# EAGLE design lab3_task2 (EAGLE 6.5.0)
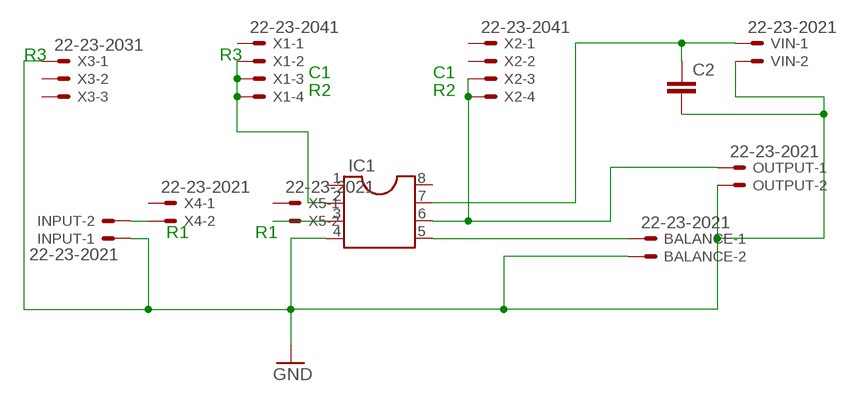
[diagram p0: schematic, sheet 1]

## Parts
BALANCE  22-23-2021  [22-23-2021]
C2  C-EU102-064X133  [C102-064X133]
IC1  DIL8  [DIL08]
INPUT  22-23-2021  [22-23-2021]
OUTPUT  22-23-2021  [22-23-2021]
VIN  22-23-2021  [22-23-2021]
X1  22-23-2041  [22-23-2041]
X2  22-23-2041  [22-23-2041]
X3  22-23-2031  [22-23-2031]
X4  22-23-2021  [22-23-2021]
X5  22-23-2021  [22-23-2021]

## Nets
GND: BALANCE.2 C2.2 IC1.4 INPUT.1 OUTPUT.2 VIN.2 X3.1
N$1: INPUT.2 X4.2
N$3: IC1.3 X5.2
N$4: C2.1 IC1.7 VIN.1
N$5: BALANCE.1 IC1.5
N$6: IC1.6 OUTPUT.1 X2.3 X2.4
N$9: IC1.2 X1.2 X1.3 X1.4
Unconnected: IC1.1 IC1.8 X1.1 X2.1 X2.2 X3.2 X3.3 X4.1 X5.1

## Notes on the sheet
- R3 | R3
- C1 | C1
- R2 | R2
- R1 | R1

## Library data of the parts
BALANCE INPUT OUTPUT VIN X4 X5 = con-molex:22-23-2021: .100" (2.54mm) Center Header - 2 Pin; MF: MOLEX; MPN: 22-23-2021; OC_FARNELL: 1462926; OC_NEWARK: 25C3832
C2 = resistor:C-EU: CAPACITOR, European symbol
IC1 = ic-package:DIL8: Dual In Line / Socket
X1 X2 = con-molex:22-23-2041: .100" (2.54mm) Center Header - 4 Pin; MF: MOLEX; MPN: 22-23-2041; OC_FARNELL: 1462920; OC_NEWARK: 38C0355
X3 = con-molex:22-23-2031: .100" (2.54mm) Center Header - 3 Pin; MF: MOLEX; MPN: 22-23-2031; OC_FARNELL: 1462950; OC_NEWARK: 30C0862

## Board
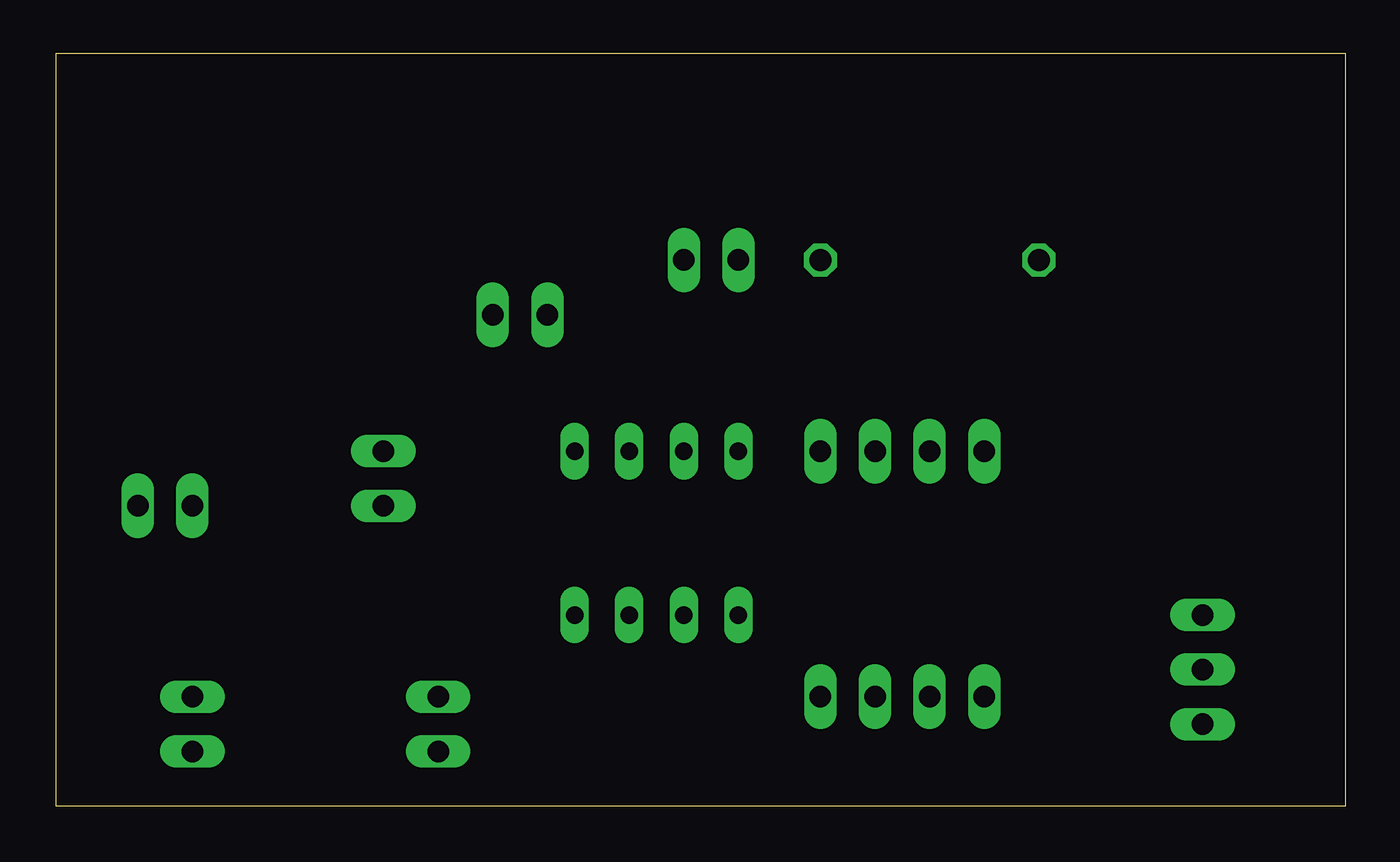
[diagram p1: board, top side]
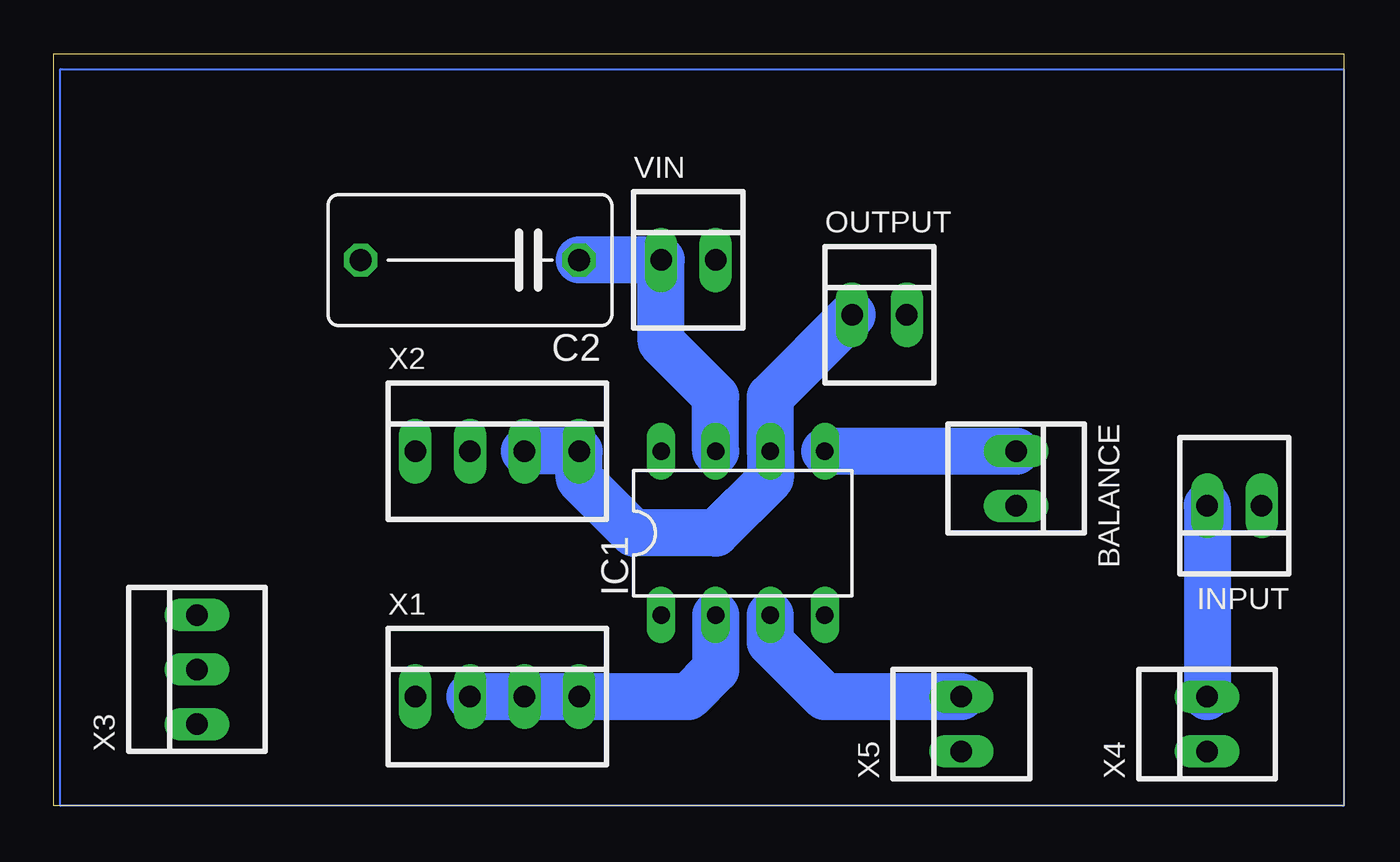
[diagram p2: board, bottom side, seen from below]

Size 60 x 35 mm. Coordinates in mm from the lower left corner, seen from the top.
Outline: 0,0 60,0 60,35 0,35 0,0
Copper layers (1*16): Top 0.035mm / dielectric 1.5mm / Bottom 0.035mm
Design rules "default": minimum track width 10mil, minimum drill 24mil, track to track 8mil, track to pad 8mil, pad to pad 8mil, via to via 8mil, smd to smd 8mil, copper to edge 40mil, drill to drill 8mil, minimum pad ring 10mil, minimum via ring 8mil, stop-mask expansion 4mil, vias tented up to drill 0mil, thermal gap 10mil

### Footprints (pad centres in the part's own frame; a part is rotated, then mirrored left to right if it is on the bottom)
22-23-2021 = drill 1 long: 1 -1.27,0; 2 1.27,0
C102-064X133 = drill 1.016 octagon: 1 -5.08,0; 2 5.08,0
DIL08 = drill 0.813 long: 1 -3.81,-3.81; 2 -1.27,-3.81; 3 1.27,-3.81; 4 3.81,-3.81; 5 3.81,3.81; 6 1.27,3.81; 7 -1.27,3.81; 8 -3.81,3.81
22-23-2041 = drill 1 long: 1 -3.81,0; 2 -1.27,0; 3 1.27,0; 4 3.81,0
22-23-2031 = drill 1 long: 1 -2.54,0; 2 0,0; 3 2.54,0

### Placement (x,y rotation side)
BALANCE  15.24,15.24 270 bottom
C2  40.64,25.4 180 bottom
IC1  27.94,12.7 0 bottom
INPUT  5.08,13.97 180 bottom
OUTPUT  21.59,22.86 0 bottom
VIN  30.48,25.4 0 bottom
X1  39.37,5.08 0 bottom
X2  39.37,16.51 0 bottom
X3  53.34,6.35 90 bottom
X4  6.35,3.81 90 bottom
X5  17.78,3.81 90 bottom

### Tracks (layer width: path | path; a pad name or v marks a point on that pad's centre or on a via)
N$1
  Bottom 2.184: INPUT.2 X4.2
N$3
  Bottom 2.184: X5.2 24.13,5.08 26.67,7.62 IC1.3
N$4
  Bottom 2.184: IC1.7 29.21,19.05 31.75,21.59 VIN.1 C2.1
N$5
  Bottom 2.184: IC1.5 BALANCE.1
N$6
  Bottom 2.184: X2.3 X2.4 35.56,15.24 33.02,12.7 29.21,12.7 26.67,15.24 IC1.6 26.67,19.05 OUTPUT.1
N$9
  Bottom 2.184: IC1.2 29.21,6.35 30.48,5.08 X1.4 X1.3 X1.2
(copper drawn outside any net)
  shapes: Bottom area x1